# EAGLE design sap_flux-v21 (EAGLE 8.0.1)

## Sheet 1 of 3
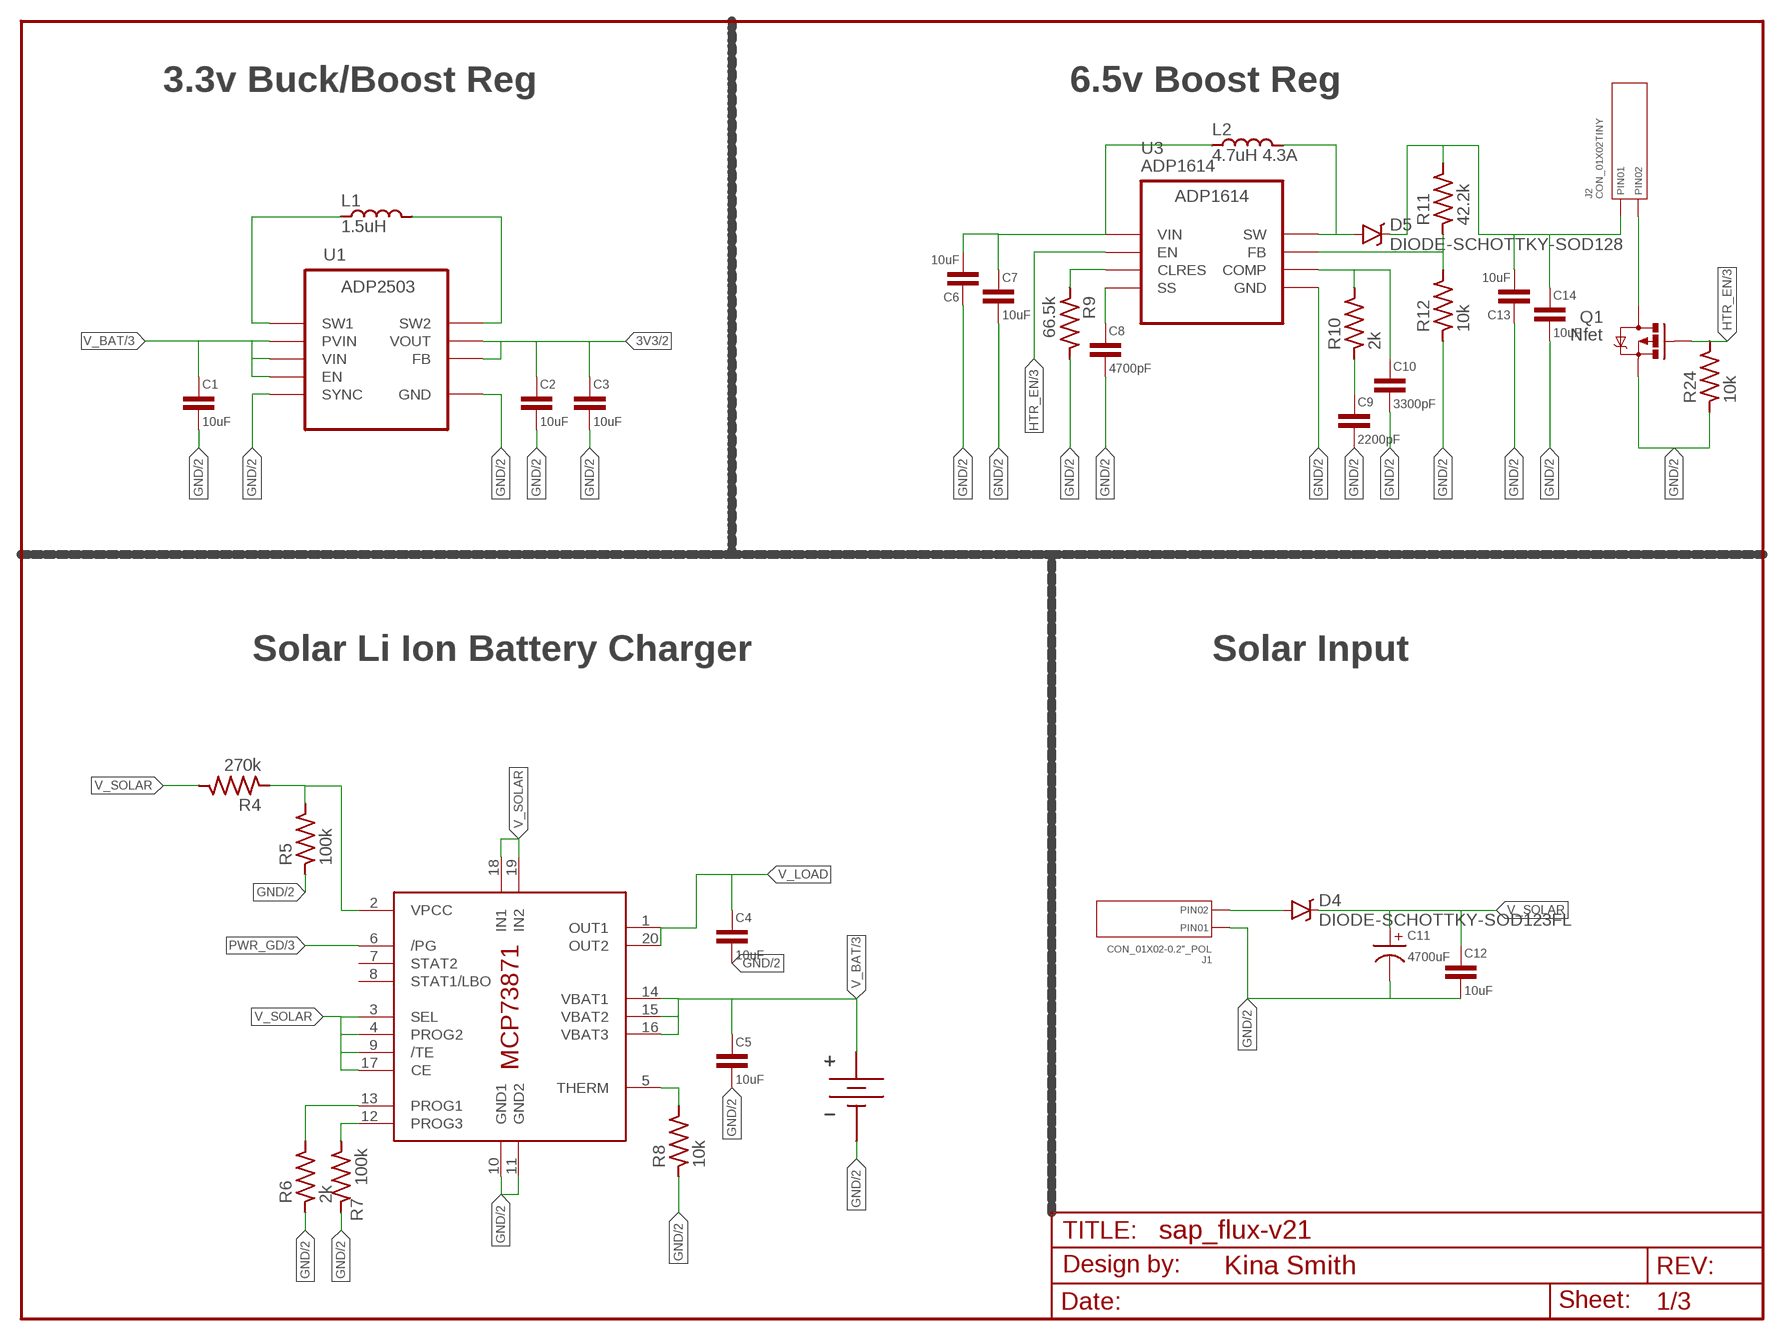
[diagram p0: schematic, sheet 1]

### Parts
BATT1  BATTERY_HOLDER-18650_CLIP  [BAT_18650_CLIP]
C1  10uF  CAPACITOR_NP0805-N  [C0805-N]
C2  10uF  CAPACITOR_NP0805-N  [C0805-N]
C3  10uF  CAPACITOR_NP0805-N  [C0805-N]
C4  10uF  CAPACITOR_NP0805-N  [C0805-N]
C5  10uF  CAPACITOR_NP0805-N  [C0805-N]
C6  10uF  CAPACITOR_NP0805-N  [C0805-N]
C7  10uF  CAPACITOR_NP0805-N  [C0805-N]
C8  4700pF  CAPACITOR_NP0603-N  [C0603-N]
C9  2200pF  CAPACITOR_NP0603-N  [C0603-N]
C10  3300pF  CAPACITOR_NP0603-N  [C0603-N]
C11  4700uF  CAPACITOR_P-TH_5MM  [CP_TH_5MM]
C12  10uF  CAPACITOR_NP0805-N  [C0805-N]
C13  10uF  CAPACITOR_NP0805-N  [C0805-N]
C14  10uF  CAPACITOR_NP0805-N  [C0805-N]
D4  DIODE-SCHOTTKY-SOD123FL  [SOD-123FL]
D5  DIODE-SCHOTTKY-SOD128  [SOD128]
FRAME1  FRAME-LETTER  [CREATIVE_COMMONS]
J1  CON_01X02-0.2"_POL  [1X02_SCREWTERM_0.2IN]
J2  CON_01X02TINY  [1X02_TINY]
L1  1.5uH  INDUCTOR3030  [L3030]
L2  4.7uH 4.3A  INDUCTOR8080  [L8080]
Q1  Nfet  MOSFET-PCHANNELSOT23-3  [SOT23-3]
R4  270k  RESISTOR0603-N  [R0603-N]
R5  100k  RESISTOR0603-N  [R0603-N]
R6  2k  RESISTOR0603-N  [R0603-N]
R7  100k  RESISTOR0603-N  [R0603-N]
R8  10k  RESISTOR0603-N  [R0603-N]
R9  66.5k  RESISTOR0603-N  [R0603-N]
R10  2k  RESISTOR0603-N  [R0603-N]
R11  42.2k  RESISTOR0603-N  [R0603-N]
R12  10k  RESISTOR0603-N  [R0603-N]
R24  10k  RESISTOR0603-N  [R0603-N]
U1  ADP2503  [DFN300X300X80-11N]
U2  MCP73871  [QFN20]
U3  ADP1614  [DFN300X300X80-11N]

### Nets
3V3: C2.1 C3.1 U1.1(VOUT) U1.10(FB) ; also sheet 2,3
6V5: C13.2 C14.1 D5.C-1(C) J2.NEG(PIN1) R11.2
6V5_INDUCTOR: D5.A-2(A) L2.2 U3.6(SW) U3.7(SW)
GND: BATT1.NEG_1(GND) BATT1.NEG_2(GND) BATT1.NEG_3(GND) C1.2 C2.2 C3.2 C4.2 C5.2 C6.1 C7.2 C8.2 C9.2 C10.2 C11.NEG C12.2 C13.1 C14.2 J1.NEG(PIN1) Q1.2(S) R5.1 R6.1 R7.1 R8.1 R9.2 R12.1 R24.1 U1.3(GND) U1.7(SYNC) U1.9(GND) U1.11(GND) U2.10(GND1) U2.11(GND2) U3.4(GND) U3.5(GND) U3.11(GND) ; also sheet 2,3
HTR_EN: Q1.1(G) R24.2 U3.3(EN) ; also sheet 3
N$5: D4.A J1.POS(PIN2)
N$7: R4.1 R5.2 U2.2(VPCC)
N$12: R6.2 U2.13(PROG1)
N$13: R7.2 U2.12(PROG3)
N$17: L1.P$1 U1.4(SW1)
N$18: L1.P$2 U1.2(SW2)
N$19: R8.2 U2.5(THERM)
N$20: J2.POS(PIN2) Q1.3(D)
N$21: C8.1 U3.10(SS)
N$22: R9.1 U3.9(CLRES)
N$26: R11.1 R12.2 U3.2(FB)
N$28: C10.1 R10.2 U3.1(COMP)
N$29: C9.1 R10.1
PWR_GD: U2.6(/PG) ; also sheet 3
V_BAT: BATT1.POS_1(VBAT) BATT1.POS_2(VBAT) BATT1.POS_3(VBAT) C1.1 C5.1 C6.2 C7.1 L2.1 U1.5(PVIN) U1.6(EN) U1.8(VIN) U2.14(VBAT1) U2.15(VBAT2) U2.16(VBAT3) U3.8(VIN) ; also sheet 3
V_LOAD: C4.1 U2.1(OUT1) U2.20(OUT2)
V_SOLAR: C11.POS C12.1 D4.C R4.2 U2.3(SEL) U2.4(PROG2) U2.9(/TE) U2.17(CE) U2.18(IN1) U2.19(IN2)
Unconnected: U2.7(STAT2) U2.8(STAT1/LBO)

### Notes on the sheet
- 3.3v Buck/Boost Reg | 6.5v Boost Reg
- Solar Li Ion Battery Charger | Solar Input

## Sheet 2 of 3
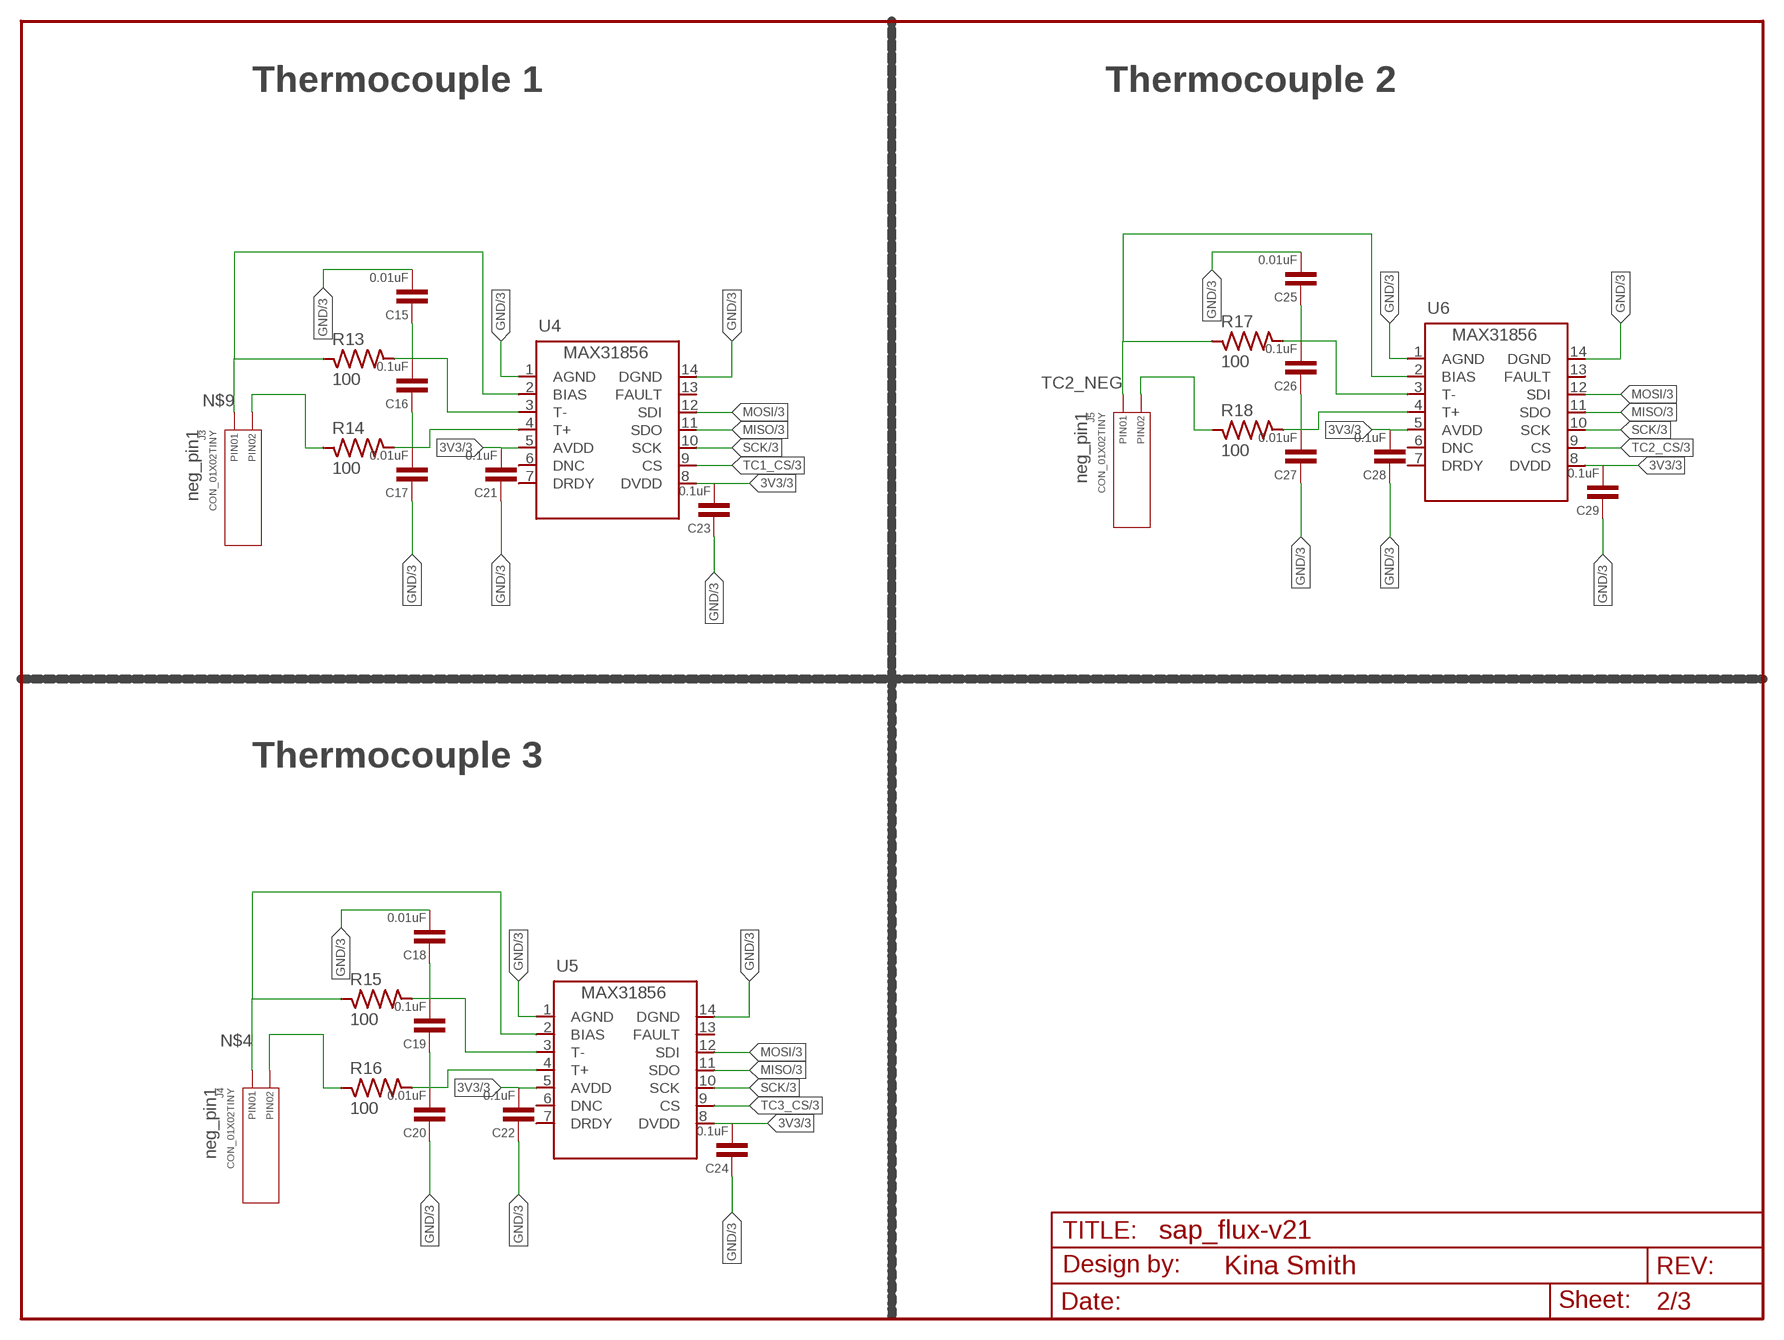
[diagram p1: schematic, sheet 2]

### Parts
C15  0.01uF  CAPACITOR_NP0603-N  [C0603-N]
C16  0.1uF  CAPACITOR_NP0603-N  [C0603-N]
C17  0.01uF  CAPACITOR_NP0603-N  [C0603-N]
C18  0.01uF  CAPACITOR_NP0603-N  [C0603-N]
C19  0.1uF  CAPACITOR_NP0603-N  [C0603-N]
C20  0.01uF  CAPACITOR_NP0603-N  [C0603-N]
C21  0.1uF  CAPACITOR_NP0603-N  [C0603-N]
C22  0.1uF  CAPACITOR_NP0603-N  [C0603-N]
C23  0.1uF  CAPACITOR_NP0603-N  [C0603-N]
C24  0.1uF  CAPACITOR_NP0603-N  [C0603-N]
C25  0.01uF  CAPACITOR_NP0603-N  [C0603-N]
C26  0.1uF  CAPACITOR_NP0603-N  [C0603-N]
C27  0.01uF  CAPACITOR_NP0603-N  [C0603-N]
C28  0.1uF  CAPACITOR_NP0603-N  [C0603-N]
C29  0.1uF  CAPACITOR_NP0603-N  [C0603-N]
FRAME2  FRAME-LETTERNO_PACKAGE  [DUMMY]
J3  CON_01X02TINY  [1X02_TINY]
J4  CON_01X02TINY  [1X02_TINY]
J5  CON_01X02TINY  [1X02_TINY]
R13  100  RESISTOR0603-N  [R0603-N]
R14  100  RESISTOR0603-N  [R0603-N]
R15  100  RESISTOR0603-N  [R0603-N]
R16  100  RESISTOR0603-N  [R0603-N]
R17  100  RESISTOR0603-N  [R0603-N]
R18  100  RESISTOR0603-N  [R0603-N]
U4  MAX31856MUD+  [TSSOP14]
U5  MAX31856MUD+  [TSSOP14]
U6  MAX31856MUD+  [TSSOP14]

### Nets
3V3: C21.2 C22.2 C23.2 C24.2 C28.2 C29.2 U4.5(AVDD) U4.8(DVDD) U5.5(AVDD) U5.8(DVDD) U6.5(AVDD) U6.8(DVDD) ; also sheet 1,3
GND: C15.2 C17.1 C18.2 C20.1 C21.1 C22.1 C23.1 C24.1 C25.2 C27.1 C28.1 C29.1 U4.1(AGND) U4.14(DGND) U5.1(AGND) U5.14(DGND) U6.1(AGND) U6.14(DGND) ; also sheet 1,3
MISO: U4.11(SDO) U5.11(SDO) U6.11(SDO) ; also sheet 3
MOSI: U4.12(SDI) U5.12(SDI) U6.12(SDI) ; also sheet 3
N$3: J4.POS(PIN2) R16.1
N$4: J4.NEG(PIN1) R15.1 U5.2(BIAS)
N$8: J3.POS(PIN2) R14.1
N$9: J3.NEG(PIN1) R13.1 U4.2(BIAS)
N$31: C19.1 C20.2 R16.2 U5.4(T+)
N$32: C18.1 C19.2 R15.2 U5.3(T-)
N$38: C16.1 C17.2 R14.2 U4.4(T+)
N$39: C15.1 C16.2 R13.2 U4.3(T-)
N$40: C25.1 C26.2 R17.2 U6.3(T-)
N$41: C26.1 C27.2 R18.2 U6.4(T+)
SCK: U4.10(SCK) U5.10(SCK) U6.10(SCK) ; also sheet 3
TC1_CS: U4.9(CS) ; also sheet 3
TC2_CS: U6.9(CS) ; also sheet 3
TC2_NEG: J5.NEG(PIN1) R17.1 U6.2(BIAS)
TC2_POS: J5.POS(PIN2) R18.1
TC3_CS: U5.9(CS) ; also sheet 3
Unconnected: U4.6(DNC) U4.7(DRDY) U4.13(FAULT) U5.6(DNC) U5.7(DRDY) U5.13(FAULT) U6.6(DNC) U6.7(DRDY) U6.13(FAULT)

### Notes on the sheet
- Thermocouple 1 | Thermocouple 2
- Thermocouple 3

## Sheet 3 of 3
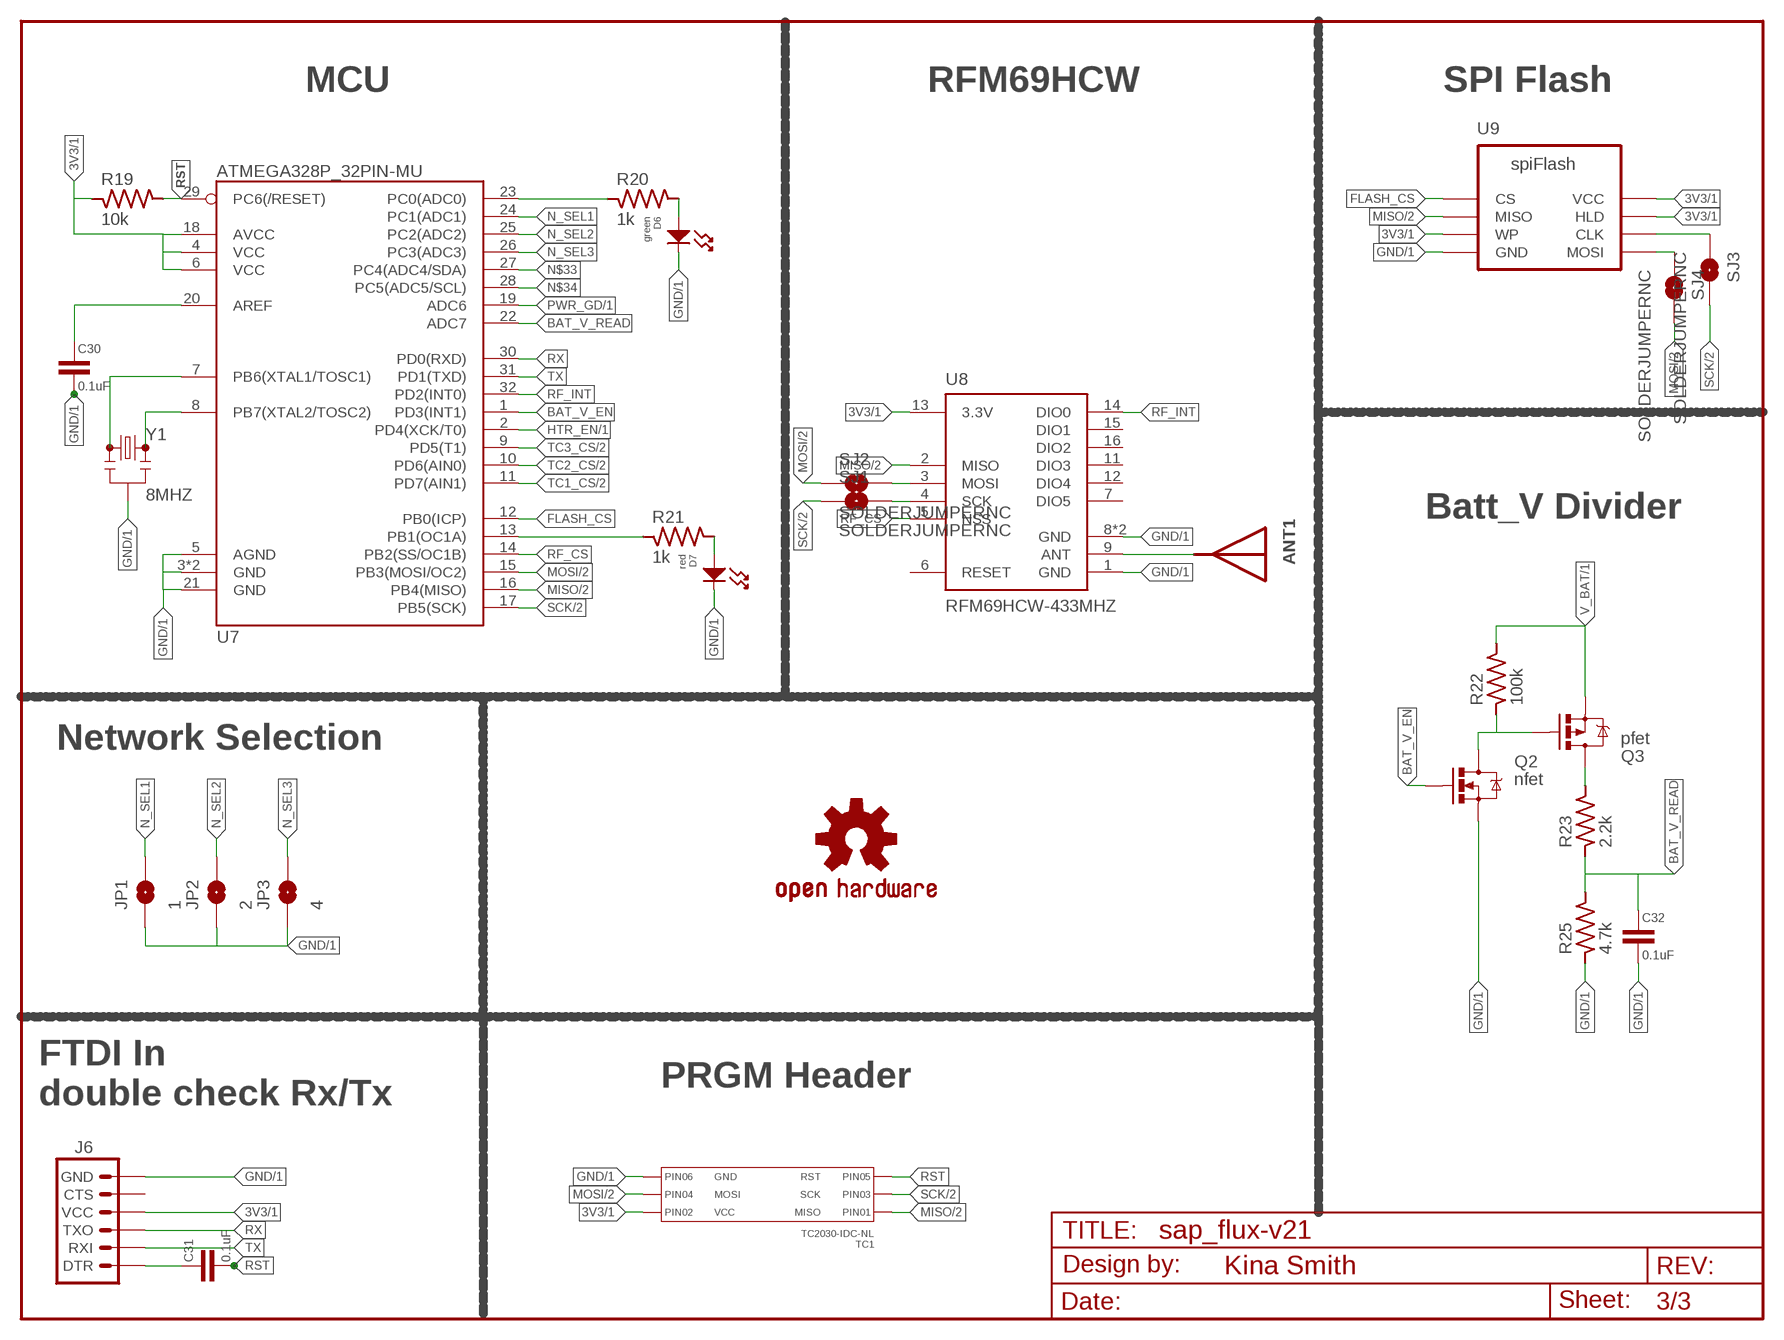
[diagram p2: schematic, sheet 3]

### Parts
ANT1  ANTENNA-433_CHIP  [ANT_433_CHIP]
C30  0.1uF  CAPACITOR_NP0603-N  [C0603-N]
C31  0.1uF  CAPACITOR_NP0603-N  [C0603-N]
C32  0.1uF  CAPACITOR_NP0603-N  [C0603-N]
D6  green  LED_SINGLE-0603  [LED0603]
D7  red  LED_SINGLE-0603  [LED0603]
FRAME3  FRAME-LETTERNO_PACKAGE  [DUMMY]
J6  ARDUINO_SERIAL_PROGRAMPTH  [1X06]
JP1  1  JUMPER-PAD-2-NOYES_SILK  [PAD-JUMPER-2-NO_YES_SILK]
JP2  2  JUMPER-PAD-2-NOYES_SILK  [PAD-JUMPER-2-NO_YES_SILK]
JP3  4  JUMPER-PAD-2-NOYES_SILK  [PAD-JUMPER-2-NO_YES_SILK]
LOGO1  OSHW-LOGOS-COPPER  [OSHW-LOGO-S_COPPER]
Q2  nfet  MOSFET-NCHANNELSOT23-3  [SOT23-3]
Q3  pfet  MOSFET-PCHANNELSOT23-3  [SOT23-3]
R19  10k  RESISTOR0603-N  [R0603-N]
R20  1k  RESISTOR0603-N  [R0603-N]
R21  1k  RESISTOR0603-N  [R0603-N]
R22  100k  RESISTOR0603-N  [R0603-N]
R23  2.2k  RESISTOR0603-N  [R0603-N]
R25  4.7k  RESISTOR0603-N  [R0603-N]
SJ1  SOLDERJUMPERNC  [SJ_2S]
SJ2  SOLDERJUMPERNC  [SJ_2S]
SJ3  SOLDERJUMPERNC  [SJ_2S]
SJ4  SOLDERJUMPERNC  [SJ_2S]
TC1  TC2030-IDC-NL  CON_02X03_AVRISP_TC2030-IDC-NL  [TC2030-IDC-NL]
U7  ATMEGA328P_32PIN-MU  [MLF32_RECTPADS]
U8  RFM69HCW-433MHZ  [RFM69HCW-XXXS2]
U9  WINBOND_FLASH_4MBIT-SOIC  [SOIC8]
Y1  8MHZ  RESONATOR8MHZ  [RESONATOR-SMD]

### Nets
3V3: J6.4(VCC) R19.1 TC1.P$2(PIN2) U7.4(VCC) U7.6(VCC) U7.18(AVCC) U8.13(3.3V) U9.3(WP) U9.7(HLD) U9.8(VCC) ; also sheet 1,2
BAT_V_EN: Q2.1(G) U7.1(PD3(INT1))
BAT_V_READ: C32.1 R23.1 R25.2 U7.22(ADC7)
FLASH_CS: U7.12(PB0(ICP)) U9.1(CS)
GND: C30.2 C32.2 D6.CATHODE D7.CATHODE J6.6(GND) JP1.1 JP2.1 JP3.1 Q2.2(S) R25.1 TC1.P$6(PIN6) U7.3(GND) U7.5(AGND) U7.21(GND) U7.PAD(GND) U8.1(GND) U8.8(GND) U8.10(GND) U9.4(GND) Y1.2 ; also sheet 1,2
HTR_EN: U7.2(PD4(XCK/T0)) ; also sheet 1
MISO: TC1.P$1(PIN1) U7.16(PB4(MISO)) U8.2(MISO) U9.2(MISO) ; also sheet 2
MOSI: SJ2.1 SJ4.2 TC1.P$4(PIN4) U7.15(PB3(MOSI/OC2)) ; also sheet 2
N$6: SJ3.1 U9.6(CLK)
N$10: SJ4.1 U9.5(MOSI)
N$15: SJ2.2 U8.3(MOSI)
N$16: SJ1.2 U8.4(SCK)
N$23: ANT1.1 U8.9(ANT)
N$24: Q3.3(D) R23.2
N$25: Q2.3(D) Q3.1(G) R22.1
N$27: R20.1 U7.23(PC0(ADC0))
N$30: C31.1 J6.1(DTR)
N$33: U7.27(PC4(ADC4/SDA))
N$34: U7.28(PC5(ADC5/SCL))
N$36: D7.ANODE R21.2
N$37: D6.ANODE R20.2
N$52: U7.8(PB7(XTAL2/TOSC2)) Y1.3
N$53: U7.7(PB6(XTAL1/TOSC1)) Y1.1
N$54: C30.1 U7.20(AREF)
N_SEL1: JP1.2 U7.24(PC1(ADC1))
N_SEL2: JP2.2 U7.25(PC2(ADC2))
N_SEL3: JP3.2 U7.26(PC3(ADC3))
PIN_9: R21.1 U7.13(PB1(OC1A))
PWR_GD: U7.19(ADC6) ; also sheet 1
RF_CS: U7.14(PB2(SS/OC1B)) U8.5(NSS)
RF_INT: U7.32(PD2(INT0)) U8.14(DIO0)
RST: C31.2 R19.2 TC1.P$5(PIN5) U7.29(PC6(/RESET))
RX: J6.3(TXO) U7.30(PD0(RXD))
SCK: SJ1.1 SJ3.2 TC1.P$3(PIN3) U7.17(PB5(SCK)) ; also sheet 2
TC1_CS: U7.11(PD7(AIN1)) ; also sheet 2
TC2_CS: U7.10(PD6(AIN0)) ; also sheet 2
TC3_CS: U7.9(PD5(T1)) ; also sheet 2
TX: J6.2(RXI) U7.31(PD1(TXD))
V_BAT: Q3.2(S) R22.2 ; also sheet 1
Unconnected: J6.5(CTS) U8.6(RESET) U8.7(DIO5) U8.11(DIO3) U8.12(DIO4) U8.15(DIO1) U8.16(DIO2)

### Notes on the sheet
- MCU | RFM69HCW | SPI Flash
- Batt_V Divider
- Network Selection
- PRGM Header
- FTDI In 
  double check Rx/Tx

## Library data of the parts
ANT1 = My_RF:ANTENNA; PARTNO: 0433AT62A0020E
BATT1 = My_Connectors:BATTERY_HOLDER; NOTE: Parts x2!!; PARTNO: 54
C1-C7 C12-C14 = My_Passives:CAPACITOR_NP; PARTNO: GRM21BR61C106KE15K
C8 = My_Passives:CAPACITOR_NP; PARTNO: GRM188R71C472KA01D
C9 = My_Passives:CAPACITOR_NP; PARTNO: GRM188R71C222KA01D
C10 = My_Passives:CAPACITOR_NP; PARTNO: C0603C332K4RACTU
C11 = My_Passives:CAPACITOR_P: Library: MF_Passives Description: Device for Polarized Capacitors. Manufacture part number (MPN), Voltage Rating, and Tolerance can be added via Attributes. Check https://factory.macrofab.com/parts for the house parts list.; PARTNO: ECA-1AM472
C15 C17 C18 C20 C25 C27 = My_Passives:CAPACITOR_NP; PARTNO: GRM188R71C103KA01D
C16 C19 C21-C24 C26 C28-C32 = My_Passives:CAPACITOR_NP; PARTNO: CC0603KRX7R7BB104
D4 = My_Descrete_Semiconductors:DIODE-SCHOTTKY: Schottky diodes in SFE's production catalog BAT20J 1A 23V 0.62Vf RB751 120mA 40V 0.37Vf PMEG4005EJ 0.5A 40V 0.42Vf MBRA140 1A 40V 0.5Vf B340A 3A 40V SMA; PARTNO: MBR120VLSFT1G
D5 = My_Descrete_Semiconductors:DIODE-SCHOTTKY: Schottky diodes in SFE's production catalog BAT20J 1A 23V 0.62Vf RB751 120mA 40V 0.37Vf PMEG4005EJ 0.5A 40V 0.42Vf MBRA140 1A 40V 0.5Vf B340A 3A 40V SMA; PARTNO: CMS05(TE12L,Q,M)
D6 = My_LEDs:LED_SINGLE: Library: MF_LEDs Description: Device for Single LED Packages. Manufacture part number (MFG#) can be added via Attributes.; HOUSEPART: NO; PARTNO: LTST-C191KGKT; POPULATE: 1
D7 = My_LEDs:LED_SINGLE: Library: MF_LEDs Description: Device for Single LED Packages. Manufacture part number (MFG#) can be added via Attributes.; HOUSEPART: NO; PARTNO: LTST-C191KRKT; POPULATE: 1
FRAME1 = My_Aesthetics:FRAME-LETTER: Schematic Frame Standard 8.5x11 US Letter frame; PARTNO: NA
FRAME2 FRAME3 = My_Aesthetics:FRAME-LETTER: Schematic Frame Standard 8.5x11 US Letter frame; DESIGNER: Nobody; PARTNO: NA; VERSION: v01
J1 = My_Connectors:CON_01X02: Library: MF_Connectors Description: Header Connector with 02 Positions and 01 Rows. Use the LABEL Attribute to label the pin on the schematic and PCB. You can remove the attributes on the PCB by using the SMASH function on the part and then deleting the text.; PARTNO: 0398890042
J2-J5 = My_Connectors:CON_01X02: Library: MF_Connectors Description: Header Connector with 02 Positions and 01 Rows. Use the LABEL Attribute to label the pin on the schematic and PCB. You can remove the attributes on the PCB by using the SMASH function on the part and then deleting the text.; NOTE: neg_pin1
J6 = My_Connectors:ARDUINO_SERIAL_PROGRAM: FTDI connector footprints; PARTNO: 68001-106HLF
JP1-JP3 = My_Passives:JUMPER-PAD-2-NO; PARTNO: NA
L1 = My_Passives:INDUCTOR; PARTNO: NR3015T1R5N
L2 = My_Passives:INDUCTOR; PARTNO: NRS8040T100MJGJ
LOGO1 = My_Aesthetics:OSHW-LOGO: Open Source Hardware Logo This logo indicates the piece of hardware it is found on incorporates a OSHW license and/or adheres to the definition of open source hardware found here: http://freedomdefined.org/OSHW
Q1 = My_Descrete_Semiconductors:MOSFET-PCHANNEL: Generic PMOSFET IRLML2244 - TRANS-11153 (SOT-23 -20V -4.3A) (1.Gate 2.Source 3.Drain) FQP27P06 - COM-10349 <http://www.sparkfun.com/products/10349> (TO-220 -60V -27A) (1.Gate 2.Source 3.Drain); PARTNO: DMN2075U-7
Q2 = My_Descrete_Semiconductors:MOSFET-NCHANNEL: Common NMOSFET Parts MFG P/N Store ID Prod ID FDD8780 TRANS-09984 SI7820DN TRANS-11055 FDS6630A IC-08089 2N7002PW TRANS-11151 FQP30N06L COM-10213 TRANS-10060 BSS123LT1G TRANS-08345 BSS138 TRANS-00830 BS170 2N7000; PARTNO: BSS138
Q3 = My_Descrete_Semiconductors:MOSFET-PCHANNEL: Generic PMOSFET IRLML2244 - TRANS-11153 (SOT-23 -20V -4.3A) (1.Gate 2.Source 3.Drain) FQP27P06 - COM-10349 <http://www.sparkfun.com/products/10349> (TO-220 -60V -27A) (1.Gate 2.Source 3.Drain); PARTNO: IRLML2244TRPBF
R4 = My_Passives:RESISTOR; PARTNO: RC0603FR-07270KL
R5 R7 R22 = My_Passives:RESISTOR; PARTNO: RC0603FR-07100KL
R6 R10 = My_Passives:RESISTOR; PARTNO: RC0603FR-072KL
R8 R12 R19 R24 = My_Passives:RESISTOR; PARTNO: RC0603FR-0710KL
R9 = My_Passives:RESISTOR; PARTNO: RC0603FR-0766K5L
R11 = My_Passives:RESISTOR; PARTNO: RC0603FR-0742K2L
R13-R18 = My_Passives:RESISTOR; PARTNO: RC0603FR-07100RL
R20 R21 = My_Passives:RESISTOR; PARTNO: RC0603FR-071KL
R23 = My_Passives:RESISTOR; PARTNO: RC0603FR-072K2L
R25 = My_Passives:RESISTOR; PARTNO: RC0603FR-074K7L
SJ1-SJ4 = My_Connectors:SOLDERJUMPER: Solder Jumper Standard SMD solder jumper. Used to automate production. Two varients : Normally Open and Normally Closed are the same, but have different paste layers. NC will have a large amount of paste and should jumper during reflow.; PARTNO: NA
TC1 = My_Connectors:CON_02X03: Library: MF_Connectors Description: Header Connector with 6 Positions and 02 Rows. Use the LABEL Attribute to label the pin on the schematic and PCB. You can remove the attributes on the PCB by using the SMASH function on the part and then deleting the text.; HOUSEPART: NO; LABEL01: MISO; LABEL02: VCC; LABEL03: SCK; LABEL04: MOSI; LABEL05: RST; LABEL06: GND; MPN: TC2030-IDC-NL; PARTNO: NA; POPULATE: 0; URL: http://www.tag-connect.com/AVRISP
U1 = My_IC_Power:ADP2503; PARTNO: ADP2503ACPZ-3.3-R7
U2 = My_IC_Power:MCP73871; PARTNO: MCP73871-2AAI/ML-ND
U3 = My_IC_Power:ADP1614: ADP1614ACPZ-R7 THIS IS THE ADJUSTABLE FREQ Version! CLRES HIGH/LOW to select Frequency! ---CHECK TO SEE IF THIS MATTERS!!; PARTNO: ADP1614ACPZ-650-R7
U4-U6 = My_IC_Digital:MAX31856MUD+; PARTNO: MAX31856MUD+
U7 = My_IC_Digital:ATMEGA328P_32PIN: Atmel 32-pin 8-bit micro 16k flash.; PARTNO: ATMEGA328P-MU
U8 = My_RF:RFM69H; PARTNO: COM-13910; PROD_ID: IC-11997, IC-12053
U9 = My_IC_Digital:WINBOND_FLASH_4MBIT; PARTNO: W25X40CLSNIG
Y1 = My_xTal:RESONATOR: Resonator Small SMD resonator. Used, eg, on the Arduino Pro/ Pro Mini boards. 8MHz- XTAL-08895 16MHz- XTAL-08900; PARTNO: CSTCE8M00G55-R0; PROD_ID: XTAL-08895

## Board
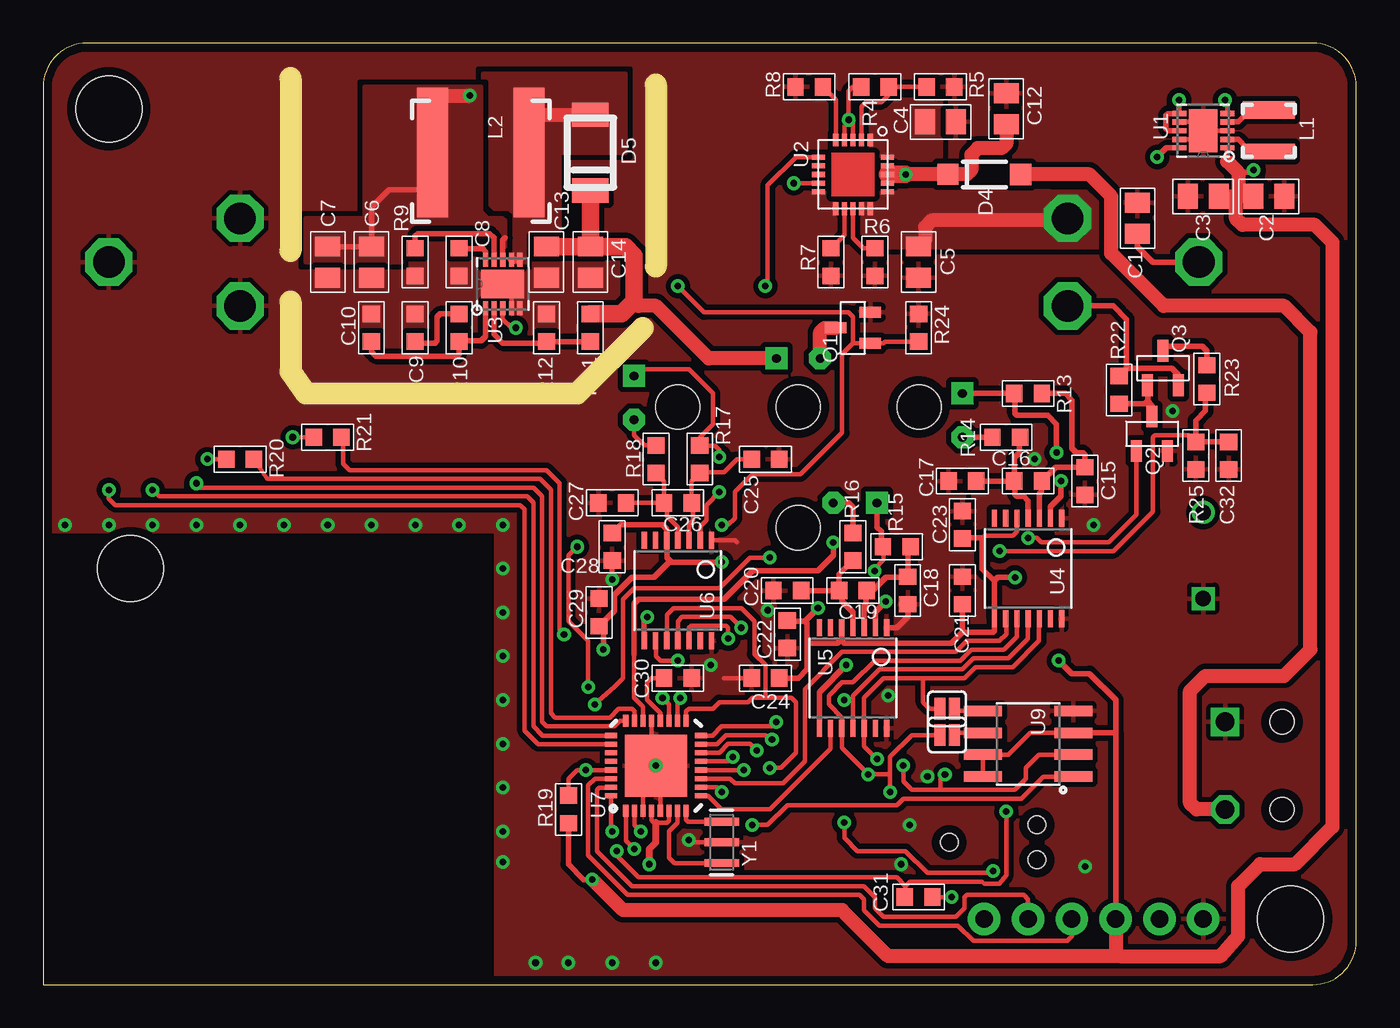
[diagram p3: board, top side]
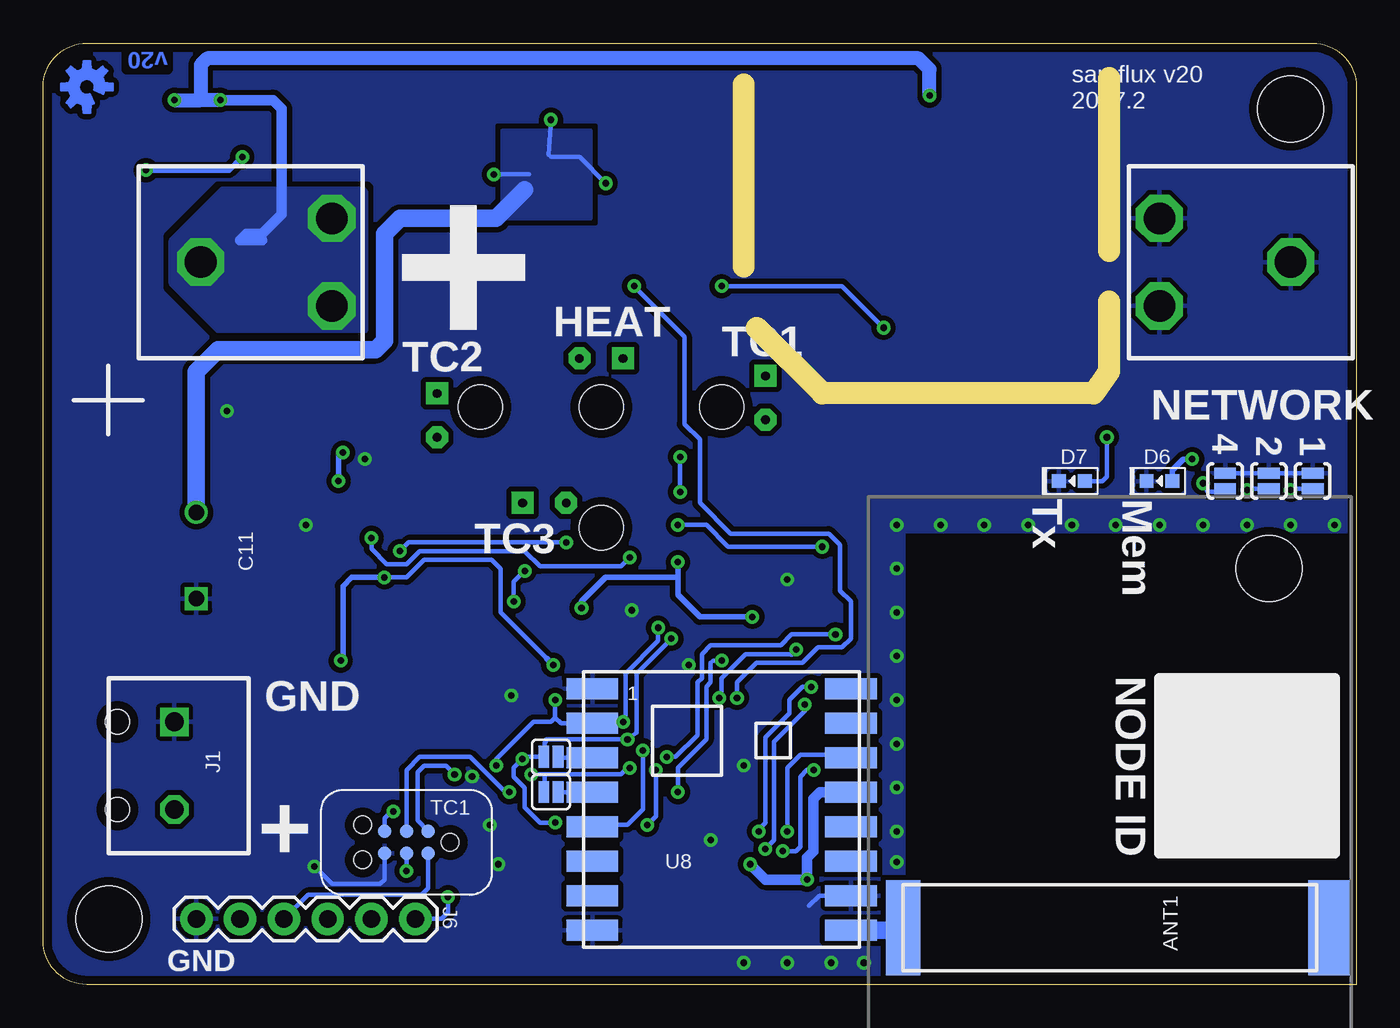
[diagram p4: board, bottom side, seen from below]

Size 76.2 x 54.61 mm. Coordinates in mm from the lower left corner, seen from the top.
Outline: 0,0 73.66,0 arc90 76.2,2.54 76.2,52.07 arc90 73.66,54.61 2.54,54.61 arc90 0,52.07 0,0
Copper layers (1*16): Top 0.0178mm / dielectric 59mil / Bottom 0.0178mm
Design rules "SSC-EAGLE-2Lyr_v1.0.0.3": minimum track width 6mil, minimum drill 14mil, track to track 6mil, track to pad 6mil, pad to pad 6mil, via to via 6mil, smd to smd 6mil, copper to edge 20mil, drill to drill 16mil, minimum pad ring 8mil, minimum via ring 8mil, stop-mask expansion 3mil, vias tented up to drill 0mil, thermal gap 10mil
Holes 2.54 mm at 43.82,26.5 43.82,33.5 50.82,33.5 36.82,33.5
Holes 3.81 mm at 5.08,24.13 3.81,50.8 72.39,3.81
Milling: 6 lines

### Footprints (pad centres in the part's own frame; a part is rotated, then mirrored left to right if it is on the bottom)
ANT_433_CHIP = smd 5.5 x 2: 1 0,1 | smd 5.5 x 2.5: 2 0,25.75
BAT_18650_CLIP = drill 1.829 octagon: NEG_1 -7.62,0; NEG_2 0,2.54; NEG_3 0,-2.54; POS_1 48.006,2.54; POS_2 48.006,-2.54; POS_3 55.626,0
C0805-N = smd 1.15 x 1.45: 1 -0.9,0; 2 0.9,0
C0603-N = smd 0.95 x 1: 1 -0.8,0; 2 0.8,0
CP_TH_5MM = drill 0.889 square: NEG -2.5,0 | drill 0.889: POS 2.5,0
SOD-123FL = smd 1.25 x 1.25: A 2.1,0 | smd 1.22 x 1.22: C -2.1,0
SOD128 = smd 1.4 x 2.1: A-2 -2.2,0; C-1 2.2,0
LED0603 = smd 0.8 x 0.8: ANODE 0.75,0; CATHODE -0.75,0
1X02_SCREWTERM_0.2IN = drill 1.092 square: NEG -2.54,0 | drill 1.092 octagon: POS 2.54,0 | hole 1.397: -2.54,-3.302; 2.54,-3.302
1X02_TINY = drill 0.508 pad 1.27 square: NEG -1.27,0 | drill 0.508 pad 1.27 octagon: POS 1.27,0
1X06 = drill 1.016 pad 1.88: 1 0,0; 2 2.54,0; 3 5.08,0; 4 7.62,0; 5 10.16,0; 6 12.7,0
PAD-JUMPER-2-NO_YES_SILK = smd 0.635 x 1.27: 1 -0.45,0; 2 0.45,0
L3030 = smd 1 x 3: P$1 -1.2,0 | smd 0.9 x 3: P$2 1.2,0
L8080 = smd 1.8 x 7.5: 1 -2.8,0; 2 2.8,0
SOT23-3 = smd 0.635 x 1.27: 1 -0.9,-1; 2 0.9,-1; 3 0,1
R0603-N = smd 0.95 x 1: 1 -0.8,0; 2 0.8,0
SJ_2S = smd 0.635 x 1.27: 1 -0.412,0; 2 0.412,0
TC2030-IDC-NL = smd 0.787 x 0.787: P$1 -1.27,-0.635; P$2 -1.27,0.635; P$3 0,-0.635; P$4 0,0.635; P$5 1.27,-0.635; P$6 1.27,0.635 | hole 0.991: 2.54,1.016; 2.54,-1.016; -2.54,0
DFN300X300X80-11N = smd 0.813 x 0.305: 1 -1.397,0.991; 2 -1.397,0.508; 3 -1.397,0; 4 -1.397,-0.508; 5 -1.397,-0.991; 6 1.397,-0.991; 7 1.397,-0.508; 8 1.397,0; 9 1.397,0.508; 10 1.397,0.991 | smd 1.651 x 2.489: 11 0,0
QFN20 = smd 0.75 x 0.3: 1 -2,1; 2 -2,0.5; 3 -2,0; 4 -2,-0.5; 5 -2,-1; 11 2,-1; 12 2,-0.5; 13 2,0; 14 2,0.5; 15 2,1 | smd 0.3 x 0.75: 6 -1,-2; 7 -0.5,-2; 8 0,-2; 9 0.5,-2; 10 1,-2; 16 1,2; 17 0.5,2; 18 0,2; 19 -0.5,2; 20 -1,2
TSSOP14 = smd 0.305 x 0.991: 1 -1.95,-2.918; 2 -1.3,-2.918; 3 -0.65,-2.918; 4 0,-2.918; 5 0.65,-2.918; 6 1.3,-2.918; 7 1.95,-2.918; 8 1.95,2.918; 9 1.3,2.918; 10 0.65,2.918; 11 0,2.918; 12 -0.65,2.918; 13 -1.3,2.918; 14 -1.95,2.918
MLF32_RECTPADS = smd 0.7 x 0.3: 1 -2.604,1.75; 2 -2.604,1.25; 3 -2.604,0.75; 4 -2.604,0.25; 5 -2.604,-0.25; 6 -2.604,-0.75; 7 -2.604,-1.25; 8 -2.604,-1.75; 17 2.604,-1.75; 18 2.604,-1.25; 19 2.604,-0.75; 20 2.604,-0.25; 21 2.604,0.25; 22 2.604,0.75; 23 2.604,1.25; 24 2.604,1.75 | smd 0.3 x 0.7: 9 -1.75,-2.604; 10 -1.25,-2.604; 11 -0.75,-2.604; 12 -0.25,-2.604; 13 0.25,-2.604; 14 0.75,-2.604; 15 1.25,-2.604; 16 1.75,-2.604; 25 1.75,2.604; 26 1.25,2.604; 27 0.75,2.604; 28 0.25,2.604; 29 -0.25,2.604; 30 -0.75,2.604; 31 -1.25,2.604; 32 -1.75,2.604 | smd 3.6 x 3.6: PAD 0,0
RFM69HCW-XXXS2 = smd 3 x 1.2: 1 -7.5,7; 2 -7.5,5; 3 -7.5,3; 4 -7.5,1; 5 -7.5,-1; 6 -7.5,-3; 7 -7.5,-5; 8 -7.5,-7; 9 7.5,-7; 10 7.5,-5; 11 7.5,-3; 12 7.5,-1; 13 7.5,1; 14 7.5,3; 15 7.5,5; 16 7.5,7
SOIC8 = smd 0.61 x 2.21: 1 -1.905,-2.616; 2 -0.635,-2.616; 3 0.635,-2.616; 4 1.905,-2.616; 5 1.905,2.616; 6 0.635,2.616; 7 -0.635,2.616; 8 -1.905,2.616
RESONATOR-SMD = smd 0.45 x 2: 1 -1.2,0; 2 0,0; 3 1.2,0

### Placement (x,y rotation side)
ANT1  27.3,3.3 270 bottom
BATT1  11.43,41.91 180 bottom
C1  63.5,44.45 90 top
C2  71.12,45.72 0 top
C3  67.31,45.72 180 top
C4  52.07,50.04 0 top
C5  50.8,41.91 270 top
C6  19.05,41.91 90 top
C7  16.51,41.91 270 top
C8  24.13,41.91 270 top
C9  21.59,38.1 90 top
C10  19.05,38.1 90 top
C11  67.31,24.89 90 bottom
C12  55.88,50.8 90 top
C13  29.21,41.91 90 top
C14  31.75,41.91 270 top
C15  60.45,29.21 270 top
C16  57.15,29.21 0 top
C17  53.34,29.21 0 top
C18  50.16,22.86 270 top
C19  46.99,22.86 0 top
C20  43.18,22.86 0 top
C21  53.34,22.86 270 top
C22  43.18,20.32 90 top
C23  53.34,26.67 270 top
C24  41.91,17.78 0 top
C25  41.91,30.48 0 top
C26  36.83,27.94 0 top
C27  33.02,27.94 0 top
C28  33.02,25.4 90 top
C29  32.26,21.59 270 top
C30  36.83,17.78 0 top
C31  50.8,5.08 180 top
C32  68.78,30.68 270 top
D4  54.61,46.99 0 top
D5  31.75,48.26 270 top
D6  11.43,29.21 0 bottom
D7  16.51,29.21 0 bottom
FRAME1  21.59,-7.62 0 top  (outside the outline)
FRAME2  -8.89,-8.89 0 top  (outside the outline)
FRAME3  35.56,0 90 top
J1  68.58,12.7 270 bottom
J2  43.81,36.32 0 top
J3  53.34,33.02 270 top
J4  47.12,27.94 180 top
J5  34.29,34.04 270 top
J6  54.61,3.81 180 bottom
JP1  7.62,29.21 270 bottom
JP2  5.08,29.21 270 bottom
JP3  2.54,29.21 270 bottom
L1  71.12,49.53 270 top
L2  25.4,48.26 0 top
LOGO1  73.66,52.07 45 bottom
Q1  46.99,38.1 90 top
Q2  64.34,31.95 0 top
Q3  64.97,35.76 0 top
R4  48.26,52.07 180 top
R5  52.07,52.07 180 top
R6  48.26,41.91 90 top
R7  45.72,41.91 90 top
R8  44.45,52.07 0 top
R9  21.59,41.91 270 top
R10  24.13,38.1 270 top
R11  31.75,38.1 90 top
R12  29.21,38.1 270 top
R13  57.15,34.29 0 top
R14  55.88,31.75 0 top
R15  49.53,25.4 0 top
R16  46.99,25.4 270 top
R17  38.1,30.48 270 top
R18  35.56,30.48 270 top
R19  30.48,10.16 90 top
R20  11.43,30.48 180 top
R21  16.51,31.75 180 top
R22  62.43,34.49 90 top
R23  67.51,35.13 90 top
R24  50.8,38.1 270 top
R25  66.88,30.68 90 top
SJ1  46.74,11.18 0 bottom
SJ2  46.74,13.21 0 bottom
SJ3  52.45,14.48 180 top
SJ4  52.45,16 180 top
TC1  55.12,8.26 180 bottom
U1  67.31,49.53 180 top
U2  46.99,46.99 270 top
U3  26.67,40.64 90 top
U4  57.15,24.13 180 top
U5  46.99,17.78 180 top
U6  36.83,22.86 180 top
U7  35.56,12.7 90 top
U8  36.83,10.16 0 bottom
U9  57.15,13.97 90 top
Y1  39.37,8.26 90 top

### Tracks (layer width: path | path; a pad name or v marks a point on that pad's centre or on a via)
3V3  (via drill 0.38)
  Top 0.254: U4.5 56.5,26.27 56.26,26.04 54.61,26.04 54.48,25.91 | 43.22,21.08 C22.2 43.09,21.21 | 36.31,9.51 36.32,9.53 36.32,10.08 U7.6 36.31,9.51 | 36.31,9.51 36.2,9.4 35.56,9.4 35.43,9.4 35.31,9.52 U7.4 | 46.35,20.68 U5.5 | C28.2 33.06,26.2 | U9.8 U9.7 56.01,13.34 57.28,14.61 U9.3 | v36.96,16.64 36.81,16.49 U7.18
  Top 0.305: 43.22,21.08 44.2,21.08 | 44.2,21.08 44.32,20.95 44.32,19.81 | v44.96,21.84 44.2,21.08 | v58.93,18.8 59.69,18.03 60.71,18.03 62.23,16.51 62.23,14.61 | U6.8 34.88,21.16 v35.05,21.34 | v32.51,19.43 32.51,20.54 C29.2 33.15,21.68 33.15,22.61 34.16,23.62 35.43,23.62 36.32,24.51 36.45,24.51 | R19.1 30.48,6.99 31.37,6.1 v31.88,6.1 | 36.45,24.51 v39.37,24.51 | 36.45,24.51 36.2,24.77 36.2,25.76 U6.5 36.18,26.43 35.94,26.67 33.49,26.67 C28.2 | 46.35,20.68 46.35,20.07 | C24.2 43.81,17.78 44.32,18.29 44.32,19.81 | 44.32,19.81 46.1,19.81 46.35,20.07 | 46.35,20.07 46.35,19.94 46.48,19.81 52.7,19.81 53.34,20.45 | 53.34,20.45 C21.2 53.51,22.23 | 53.34,20.45 55.12,20.45 55.2,20.53 U4.8 55.2,23.41 | 55.2,23.41 54.48,24.13 54.48,25.91 53.38,25.91 C23.2 | 55.2,23.41 55.41,23.62 v56.39,23.62 | v46.61,18.54 45.04,16.97 U5.8 | 68.58,47.62 68.71,47.75 U1.1 | U1.10 65.18,48.54 v64.64,48.01 | v70.23,47.24 70.1,47.12 69.34,47.12 | 62.23,14.61 J6.4 | U9.3 62.23,14.61
  Top 0.406: v35.18,6.99 35.18,7.87 35.56,8.26 35.56,9.4
  Top 0.813: 62.48,1.65 68.33,1.65 69.34,2.79 69.34,5.71 70.61,6.99 72.64,6.99 74.8,9.14 74.8,43.05 73.79,44.07 69.6,44.07 69.22,44.45 69.22,45.59 69.09,45.72 | J6.4 62.23,1.91 62.48,1.65 | 62.48,1.65 49.02,1.65 46.35,4.32 33.66,4.32 v31.88,6.1 | C3.1 69.09,45.72 | 69.09,45.72 69.34,45.72 | 69.34,45.72 C2.1 | 68.71,47.75 69.34,47.12 69.34,45.72
  Bottom 0.254: TC1.P$2 53.85,5.59 54.23,5.21 60.83,5.21 J6.4 | 32.77,19.18 35.43,19.18 36.83,17.78 36.83,16.76 v36.96,16.64 | 46.99,18.92 49.66,21.59 49.66,24.13 50.16,24.64 54.1,24.64 55.12,23.62 v56.39,23.62
  Bottom 0.305: v56.39,23.62 58.29,23.62 58.8,23.11 58.8,19.18 v58.93,18.8 | 46.99,18.92 v46.61,18.54 | v35.05,21.34 38.1,21.34 39.37,22.61 39.37,23.62 | 39.37,23.62 v39.37,24.51 | v44.96,21.84 44.96,22.23 43.56,23.62 39.37,23.62 | 32.77,19.18 v32.51,19.43 | v64.64,48.01 65.41,47.24 v70.23,47.24
  Bottom 0.61: U8.13 31.13,11.16 31.5,10.79 31.5,7.75 31.88,7.37 v31.88,6.1 34.29,6.1 v35.18,6.99
6V5
  Top 0.813: J2.NEG 38.61,36.32 35.56,39.37 34.54,39.37 34.29,39.62
  Top 1.016: C14.1 D5.C-1 | C13.2 C14.1 | C14.1 31.76,42.8 33.78,42.8 34.29,42.29 34.29,39.62 33.57,38.9 R11.2
6V5_INDUCTOR
  Top 0.305: 27.66,47.72 L2.2 28.2,48.52 | 31.71,50.42 D5.A-2
  Top 0.406: U3.7 U3.6
  Top 0.813: 31.71,50.42 28.83,50.42 27.94,49.53 27.94,48.52 L2.2
  pour Top (isolate 0.305, rank 5, no thermals): 26.92,41.53 27.94,41.53 27.94,43.69 29.97,43.69 29.97,48.26 33.78,48.26 33.78,52.83 25.53,52.83 25.53,44.45 26.92,44.45
BAT_V_EN  (via drill 0.38)
  Top 0.254: v57.15,25.91 57.66,25.91 57.91,25.65 61.85,25.65 63.44,27.25 Q2.1 | v32,16.26 33.15,17.27 33.66,17.78 33.66,22.35 34.29,22.99 39.24,22.99 41.02,24.77 v42.16,24.77 | 33.78,10.07 U7.1 33.81,8.35 v34.29,7.87
  Bottom 0.254: v32,16.26 32,15.88 33.78,14.1 33.78,8.38 v34.29,7.87 | v57.15,25.91 57.15,25.27 56.26,24.38 55.12,24.38 54.36,25.15 48.26,25.15 47.37,24.26 42.67,24.26 v42.16,24.77
BAT_V_READ  (via drill 0.38)
  Top 0.254: v55.5,25.15 62.1,25.15 64.39,27.43 64.39,31.75 64.52,31.88 66.49,31.88 R25.2 | U7.22 34.81,16.12 34.29,16.64 34.29,19.18
  Top 0.305: v45.85,25.65 45.85,24.89 44.96,24 41.15,24 39.5,22.35 34.54,22.35 34.29,22.1 34.29,19.18 | R25.2 67.01,31.61 | C32.1 R25.2 | R25.2 66.88,32.72 67.44,33.27 67.44,34.25 R23.1
  Bottom 0.254: v45.85,25.65 54.99,25.65 v55.5,25.15
FLASH_CS  (via drill 0.38)
  Top 0.254: v41.15,9.27 42.04,9.27 43.18,10.41 49.53,10.41 49.91,10.79 56.77,10.79 58.04,12.06 U9.1 | U7.12 v40.64,12.45
  Bottom 0.254: v41.15,9.27 40.64,9.78 v40.64,12.45
GND  (via drill 0.38)
  Top 0.254: U1.3 U1.11 | U1.9 66.8,49.02 U1.11 | U1.11 67.31,50.04 U1.7 | U3.4 27.18,40.13 U3.11 | U7.21 35.31,12.95 U7.PAD | U6.1 40.13,25.78 40.26,25.65 | Y1.2 37.59,8.26 v37.47,8.38 | C24.1 39.5,17.78 | U7.5 35.81,12.45 U7.PAD | U7.3 34.81,11.95 U7.PAD
  Top 0.305: C28.1 33.02,23.62 33.15,23.5 | U5.1 49.53,20.7 50.16,21.34 C18.2
  Bottom 0.254: v37.47,8.38 37.47,8.51 37.34,8.64 | v38.73,18.54 38.61,18.67 | TC1.P$6 56.39,6.1 56.64,5.84 59.44,5.84 v60.45,6.86 | U8.10 31.16,5.16 31.75,4.57 | JP1.1 JP2.1 JP3.1
  other vias: 35.56,12.7 42.04,21.72 1.27,26.67 3.81,26.67 6.35,26.67 8.89,26.67 11.43,26.67 13.97,26.67 16.51,26.67 19.05,26.67 21.59,26.67 24.13,26.67 26.67,26.67 26.67,24.13 26.67,21.59 26.67,19.05 26.67,16.51 26.67,13.97 26.67,11.43 26.67,8.89 33.02,23.5 28.57,1.27 30.48,1.27 33.02,1.27 35.56,1.27 26.67,7.11 50.29,9.27 49.78,6.99 60.96,26.67 65.53,33.27 57.53,30.48 49.02,16.76 51.31,12.06
  pour Top (isolate 0.305, rank 6): 26.29,0 26.29,26.29 0,26.29 0,54.61 76.2,54.61 76.2,0
  pour Bottom (isolate 0.305, rank 6): 26.29,0 26.29,26.29 0,26.29 0,54.61 76.2,54.61 76.2,0
  pour Top (isolate 0.305, rank 6, no thermals): 14.86,41.91 34.29,41.91 34.29,38.1 26.8,38.1 26.8,39.37 22.35,39.37 22.35,38.1 14.86,38.1
  pour Top (isolate 0.305, rank 6, no thermals): 46.23,46.35 44.45,46.35 44.45,43.69 46.23,43.69
HTR_EN  (via drill 0.38)
  Top 0.254: U7.2 34.31,9.25 v34.67,8.89 | R24.2 48.86,37.3 48.77,37.21 47.98,37.21 Q1.1 | v31.62,17.27 31.62,19.94 30.48,21.08 30.48,24.89 v30.99,25.4 | v39.37,26.67 39.75,26.67 40.13,27.05 40.13,28.57 41.15,29.59 43.94,29.59 46.35,32 46.35,36.58 46.99,37.21 | Q1.1 47.87,37.08 47.75,37.21 46.99,37.21 | Q1.1 | 46.99,37.21 46.99,38.73 46.74,38.99 38.35,38.99 v36.83,40.51 | v27.43,38.1 27.18,38.1 26.67,38.61 U3.3
  Bottom 0.254: v34.67,8.89 34.67,9.02 34.29,9.4 34.29,14.35 32.89,15.75 32.89,16.51 32.13,17.27 v31.62,17.27 | v30.99,25.4 36.45,25.4 37.72,26.67 v39.37,26.67 | v27.43,38.1 29.84,40.51 v36.83,40.51
MISO  (via drill 0.38)
  Top 0.254: U7.16 38.83,14.45 39.37,14.99 42.29,14.99 v42.55,15.24 | U6.11 36.83,21.08 37.08,21.34 39.88,21.34 v40.51,20.7 | U4.11 57.15,20.07 56.01,18.92 53.98,18.92 53.34,18.29 48.51,18.29 46.99,16.76 46.99,16.51 | v49.91,12.7 49.91,11.81 50.42,11.3 52.07,11.3 | 46.99,16.51 U5.11 | v46.48,16.51 46.99,16.51 | 52.07,11.3 56.39,11.3 57.02,11.94 57.02,12.57 57.78,13.34 U9.2 | 52.07,11.3 52.07,11.94 v52.32,12.19
  Bottom 0.254: U8.2 44.38,15.11 44.83,15.11 | v40.51,20.7 40.51,19.94 42.42,18.03 42.42,15.37 v42.55,15.24 42.62,15.16 U8.2 | 53.85,9.14 TC1.P$1 54.48,9.53 54.48,12.32 54.1,12.7 52.83,12.7 v52.32,12.19 | U8.2 46.15,15.16 46.48,15.49 | 46.48,15.49 v46.48,16.51 | v49.91,12.7 49.91,13.08 47.75,15.24 46.74,15.24 46.48,15.49
MOSI  (via drill 0.38)
  Top 0.254: U7.15 39.1,13.95 39.62,14.48 41.91,14.48 v42.29,14.22 | U6.12 37.48,20.72 37.59,20.83 39.62,20.83 39.75,20.7 v39.75,20.07 | U4.12 57.78,21.2 57.78,19.94 56.26,18.41 54.1,18.41 53.47,17.78 51.18,17.78 | 51.18,17.78 48.77,17.78 47.62,16.64 47.62,14.88 | v55.12,6.6 54.99,6.48 51.31,6.48 50.04,7.75 47.24,7.75 46.48,8.51 v46.48,9.4 | SJ4.2 51.44,16 51.05,16.38 51.05,17.65 51.18,17.78 | U5.12 47.64,13.83 v48.39,13.08
  Top 0.305: 47.62,14.88 U5.12
  Bottom 0.254: v39.75,20.07 41.78,18.03 41.78,14.61 v42.29,14.22 46.99,14.22 47.12,13.97 47.12,13.24 SJ2.1 48.26,13.21 v48.39,13.08 48.9,12.57 48.9,12.06 48.26,11.43 48.26,10.29 47.37,9.4 v46.48,9.4 | TC1.P$4 v55.12,6.6
N$3
  Top 0.305: R16.1 46.99,27.69 46.74,27.94 J4.POS
N$4  (via drill 0.38)
  Top 0.254: v48.26,24 48.26,24.13 48.77,24.64 48.77,25.36 R15.1
  Top 0.305: J4.NEG 48.39,26.54 48.64,26.29 48.64,25.49 R15.1 | U5.2 48.29,21.62 v48.9,22.23
  Bottom 0.254: v48.9,22.23 48.9,23.37 v48.26,24
N$5
  Top 0.813: J1.POS 66.93,10.16 66.55,10.54 66.55,17.02 67.44,17.91 72.01,17.91 73.53,19.43 73.53,37.85 72.01,39.37 65.02,39.37 61.98,42.42 61.98,45.72 60.71,46.99 D4.A
N$6
  Top 0.254: U9.6 52.99,14.61 SJ3.1
N$7
  Top 0.254: U2.2 47.49,50.92 47.75,51.18 48.64,51.18 49.02,51.56 49.02,52.03 R4.1 R5.2
N$8
  Top 0.305: R14.1 J3.POS
N$9  (via drill 0.38)
  Top 0.305: U4.2 58.45,27.72 59.05,28.32 v59.05,29.21 | v58.8,30.86 58.8,32.51 58.29,33.02 56.52,33.02 56.39,33.15 56.39,34.25 R13.1 J3.NEG
  Bottom 0.305: v59.05,29.21 59.05,30.61 v58.8,30.86
N$10
  Top 0.254: U9.5 52.99,15.88 SJ4.1
N$12
  Top 0.254: R6.2 47.59,42.71 46.99,43.31 U2.13
N$13
  Top 0.254: U2.12 46.49,43.48 R7.2
N$15
  Bottom 0.254: U8.3 46.28,13.16 SJ2.2
N$16
  Bottom 0.254: U8.4 46.31,11.16 SJ1.2
N$17
  Top 0.254: L1.P$1 70.03,50.73
  Top 0.305: U1.4 69.34,50.04 70.03,50.73
N$18
  Top 0.305: U1.2 69.34,49.02 69.85,48.51 70.94,48.51 L1.P$2
N$19
  Top 0.254: U2.5 45.99,51.33 R8.2
N$20
  Top 0.813: J2.POS 45.09,37.85 45.34,38.1 Q1.3
N$21
  Top 0.305: U3.10 25.68,42.52 25.53,42.67 24.17,42.67 C8.1
N$22
  Top 0.305: U3.9 26.16,43.31 25.91,43.56 21.72,43.56 21.59,43.43 R9.1
N$23
  Bottom 1.016: U8.9 26.29,3.16 ANT1.1
N$24
  Top 0.305: R23.2 67.52,36.78 67.26,37.03 65.25,37.03 Q3.3
N$25
  Top 0.305: Q2.3 64.34,33.6 64.09,33.86 | 64.09,33.86 64.09,34.75 Q3.1 | R22.1 63.92,33.69 64.09,33.86
N$26
  Top 0.305: U3.2 26.16,37.72 26.67,37.21 29.12,37.21 R12.2 R11.1
N$27
  Top 0.254: R20.1 12.99,29.34 28.83,29.34 29.46,28.7 29.46,15.75 29.72,15.49 32.89,15.49 33.4,16 34.16,16 34.31,15.86 U7.23
N$28
  Top 0.305: U3.1 25.68,37.62 25.4,37.34 24.17,37.34 R10.2 24.13,36.58 24,36.45 19.3,36.45 19.05,36.7 C10.1
N$29
  Top 0.305: R10.1 23.02,38.9 22.86,38.73 22.86,37.34 22.73,37.21 21.68,37.21 C9.1
N$30  (via drill 0.38)
  Top 0.254: C31.1 v52.7,5.08
  Bottom 0.254: J6.1 53.09,3.81 52.7,4.19 v52.7,5.08
N$31
  Top 0.305: U5.4 46.99,21.59 46.35,22.23 46.35,22.7 C19.1 | C20.2 C19.1 | C19.1 46.19,23.8 R16.2
N$32
  Top 0.305: U5.3 47.64,21.99 47.75,22.1 47.75,22.82 C19.2 48.13,22.86 48.9,23.62 50.13,23.62 C18.1 50.16,25.23 R15.2
N$36  (via drill 0.38)
  Top 0.254: R21.2 v14.48,31.75
  Bottom 0.254: v14.48,31.75 14.48,29.46 14.73,29.21 D7.ANODE
N$37  (via drill 0.38)
  Top 0.254: R20.2 v9.53,30.48
  Bottom 0.305: D6.ANODE 10.68,29.83 10.03,30.48 v9.53,30.48
N$38
  Top 0.305: U4.4 57.15,28.07 56.9,28.32 56.52,28.32 56.39,28.45 56.39,29.17 C16.1 | C16.1 56.35,30.57 56.64,30.86 56.64,31.71 R14.2 | C16.1 C17.2
N$39
  Top 0.305: U4.3 57.8,28.46 57.91,28.57 57.91,29.17 C16.2 58.75,30.01 C15.1 60.45,30.73 60.33,30.86 59.94,30.86 59.69,31.11 59.69,33.91 59.31,34.29 R13.2
N$40
  Top 0.254: U6.3 37.48,26.68 37.72,26.92 37.72,27.85 C26.2 37.63,29.21 R17.2 38.14,29.72 39.5,29.72 40.26,30.48 C25.1
N$41
  Top 0.254: U6.4 36.83,26.54 36.2,27.18 36.2,27.77 C26.1 | C26.1 C27.2 | C26.1 36.03,29.21 R18.2
N$52
  Top 0.254: Y1.3 37.41,9.46 37.31,9.55 U7.8
N$53
  Top 0.254: U7.7 36.81,9.38 36.32,8.89 36.32,7.37 36.63,7.05 Y1.1
N$54
  Top 0.254: U7.20 35.81,15.75 35.05,16.51 35.05,17.53 35.31,17.78 C30.1
N_SEL1  (via drill 0.38)
  Top 0.254: v8.89,29.08 9.14,28.83 28.45,28.83 28.96,28.32 28.96,15.24 29.21,14.99 33.15,14.99 33.47,15.3 U7.24
  Bottom 0.254: v8.89,29.08 8.64,28.57 7.8,28.57 JP1.2
N_SEL2  (via drill 0.38)
  Top 0.254: v6.35,28.7 6.73,28.32 28.07,28.32 28.45,27.94 28.45,14.99 28.98,14.45 U7.25
  Bottom 0.254: JP2.2 6.29,28.76 v6.35,28.7
N_SEL3  (via drill 0.38)
  Top 0.254: v3.81,28.7 3.81,28.19 4.19,27.81 27.69,27.81 27.94,27.56 27.94,14.73 28.72,13.95 U7.26
  Bottom 0.254: JP3.2 3.75,28.76 v3.81,28.7
PIN_9  (via drill 0.38)
  Top 0.254: R21.1 17.4,31.66 17.4,30.23 17.78,29.84 29.21,29.84 29.97,29.08 29.97,20.57 v30.23,20.32 | U7.13 39.75,12.95 v40.01,13.21
  Bottom 0.254: v30.23,20.32 32.77,20.32 33.4,19.68 37.47,19.68 37.97,19.18 37.97,17.78 38.23,17.53 38.23,14.48 39.5,13.21 v40.01,13.21
PWR_GD  (via drill 0.38)
  Top 0.254: U2.6 43.67,47.99 42.04,46.35 42.04,40.51 v41.91,40.51 | v35.94,16.64 36.31,16.27 U7.19
  Bottom 0.254: v41.91,40.51 38.99,37.59 38.99,32.51 38.1,31.62 38.1,27.94 36.32,26.16 30.61,26.16 29.97,25.53 29.97,22.86 29.34,22.23 29.34,20.07 29.84,19.56 31.24,19.56 32.13,18.67 34.8,18.67 35.94,17.53 v35.94,16.64
RF_CS  (via drill 0.38)
  Top 0.254: U7.14 39.23,13.45 39.75,13.97 41.02,13.97 v41.4,13.59
  Bottom 0.254: v41.4,13.59 41.4,10.16 42.29,9.27 44.22,9.27 U8.5
RF_INT  (via drill 0.38)
  Top 0.254: U7.32 32.96,8.95 v33.02,8.89
  Bottom 0.254: 29.41,13.08 U8.14 29.5,13.34 32.26,13.34 33.02,12.57 v33.02,8.89
RST  (via drill 0.38)
  Top 0.254: U7.29 v31.5,12.45 30.99,12.45 30.48,11.94 R19.2 | v33.27,7.75 33.27,7.49 34.54,6.22 49.53,6.22 50.04,5.71 | 50.04,5.71 50.04,5.12 C31.2 | v55.88,10.03 55.88,6.35 55.5,5.84 54.61,5.84 54.48,5.97 50.29,5.97 50.04,5.71
  Bottom 0.254: v31.5,12.45 31.75,12.45 31.87,12.45 32.26,12.06 32.26,8 32.51,7.75 v33.27,7.75 | TC1.P$5 56.39,9.65 56.01,10.03 v55.88,10.03
RX
  Top 0.254: U7.30 32.02,11.95 31.62,11.56 31.62,7.49 33.91,5.21 47.37,5.21 47.62,4.95 47.62,4.32 48.51,3.43 53.09,3.43 53.98,2.54 59.44,2.54 59.69,2.79 J6.3
SCK  (via drill 0.38)
  Top 0.254: U6.10 36.2,19.93 36.2,21.46 36.58,21.84 40.51,21.84 41.27,21.08 41.27,19.18 41.91,18.54 41.91,16.64 | U7.17 37.31,15.85 37.47,16 38.86,16 39.24,16.38 40.89,16.38 41.15,16.64 41.91,16.64 | U4.10 56.5,20.18 55.75,19.43 53.85,19.43 53.21,18.8 48.26,18.8 46.99,17.53 46.35,17.53 45.59,16.76 45.59,16.26 46.35,15.49 46.35,14.88 | v42.16,12.57 42.8,12.57 43.69,13.46 43.69,16.38 43.43,16.64 41.91,16.64 | SJ3.2 50.42,14.48 49.15,13.21 49.15,12.19 | U5.10 46.34,13.73 v47.88,12.19 49.15,12.19 | 49.15,12.19 v49.15,11.18
  Top 0.305: 46.35,14.85 U5.10 46.35,14.88
  Bottom 0.254: 55.12,9.14 TC1.P$3 55.12,12.45 54.36,13.21 51.44,13.21 49.4,11.18 v49.15,11.18 | v42.16,12.57 42.29,12.57 42.67,12.19 46.99,12.19 | 46.99,12.19 47.12,12.06 47.12,11.21 SJ1.1 | 46.99,12.19 v47.88,12.19
TC1_CS
  Top 0.254: U4.9 55.88,21.18 55.88,20.32 55.5,19.94 53.59,19.94 52.96,19.3 46.35,19.3 44.2,17.14 44.2,12.95 42.93,11.68 40.13,11.68 39.87,11.95 U7.11
TC2_CS  (via drill 0.38)
  Top 0.254: U6.9 35.56,19.91 35.56,19.05 35.81,18.8 v36.83,18.8 | U7.10 39.1,11.45 v39.37,11.18
  Bottom 0.254: v39.37,11.18 39.37,12.57 37.72,14.22 37.72,17.27 37.47,17.53 37.47,18.67 37.34,18.8 v36.83,18.8
TC2_NEG  (via drill 0.38)
  Top 0.254: U6.2 38.13,26.57 38.48,26.92 38.48,27.81 v39.24,28.57 | v39.24,30.61 39.24,30.99 38.99,31.24 38.14,31.24 R17.1 38.1,31.75 38.86,32.51 38.86,34.29 37.47,35.69 34.67,35.69 J5.NEG
  Bottom 0.254: v39.24,28.57 v39.24,30.61
TC2_POS
  Top 0.254: R18.1 34.89,31.28 34.29,31.88 J5.POS
TC3_CS
  Top 0.254: U5.9 45.69,13.69 42.16,10.16 39.37,10.16 38.58,10.95 U7.9
TX
  Top 0.254: U7.31 32.94,11.43 32.26,11.43 32.13,11.3 32.13,7.75 34.16,5.71 47.62,5.71 48.26,5.08 48.26,4.45 48.77,3.94 52.96,3.94 53.47,4.45 53.47,5.08 53.59,5.21 56.9,5.21 57.15,4.95 J6.2
V_BAT  (via drill 0.38)
  Top 0.254: v65.91,51.31 U1.6 65.89,50.55 | U1.5 68.71,51.18 v68.58,51.31
  Top 0.305: U1.8 65.28,49.53 65.15,49.66 65.15,50.42 65.25,50.52 U1.6 | BATT1.POS_3 64.39,41.91 63.5,42.8 C1.1 | L2.1 22.73,48.13 22.73,46.1 20.07,46.1 19.05,45.09 C6.2 C7.1 | U3.8 26.67,43.18 26.8,43.31 | Q3.2 65.88,35.37 65.48,35.76 62.91,35.76 | 62.91,35.76 R22.2 | BATT1.POS_1 62.1,39.37 62.87,38.61 62.87,35.8 62.91,35.76
  Top 0.813: 59.82,44.32 51.56,44.32 51.18,43.94 51.18,43.19 C5.1 | 22.33,48.53 L2.1 | 22.73,46.1 22.73,51.56 v24.77,51.56
  Bottom 0.61: 67.06,51.31 62.87,51.31 62.36,50.8 62.36,44.69 C1.1 64.4,43.55 64.77,43.18 63.5,43.18
  Bottom 0.813: v65.91,51.31 67.06,51.31 | v68.58,51.31 67.06,51.31 | v24.77,51.56 24.77,53.09 25.4,53.72 66.67,53.72 67.06,53.34 67.06,51.31
  pour Top (isolate 0.305, rank 5, no thermals): 47.24,46.1 47.12,42.8 61.21,42.8 61.21,45.97
  pour Bottom (isolate 0.305, rank 5, no thermals): 68.71,40.64 68.71,43.18 65.79,46.1 57.66,46.1 57.53,45.97 57.53,37.97 66.04,37.97
  pour Top (isolate 0.305, rank 3, no thermals): 26.29,41.66 26.8,41.66 26.8,44.32 26.67,44.45 25.78,44.45 25.4,44.83 25.4,52.07 18.67,52.07 18.67,44.45 15.24,44.45 15.24,41.91 26.04,41.91
V_LOAD
  pour Top (isolate 0.305, rank 5, no thermals): 47.75,47.75 52.07,47.75 52.07,51.31 47.75,51.31
V_SOLAR  (via drill 0.38)
  Top 0.254: U2.4 46.49,49.79 v46.74,50.16 | U2.3 46.99,50.04 v46.74,50.16 | R4.2 46.99,52.07 46.74,51.82 v46.74,50.16 | U2.19 U2.18 U2.17 | U2.9 v43.56,46.48
  Top 0.813: v50.04,46.99 D4.C 53.59,46.99 53.85,47.24 53.85,48.13 54.23,48.51 55.63,48.51 55.88,48.77 C12.1
  Top 1.016: v50.04,46.99 U2.18
  Bottom 0.254: v46.74,50.16 46.86,48.13 46.74,48.01 45.09,48.01 v43.56,46.48 | v50.04,46.99 48.01,46.99
  Bottom 1.016: 48.26,46.1 49.91,44.45 55.5,44.45 56.39,43.56 56.39,37.34 56.9,36.83 66.04,36.83 67.31,35.56 C11.POS
  pour Bottom (isolate 0.305, rank 4, no thermals): 44.45,49.53 49.53,49.53 49.53,44.45 44.45,44.45

### Text on the board
Bottom: v20
bPlace: + | NETWORK | NODE ID | GND | +
bNames: sap flux v20 / 2017.2 | HEAT | TC1 | TC2 | 1 | 2 | 4 | Mem | Tx | TC3 | GND